# Altium project BLE_Motion_Tracker.PrjPcb
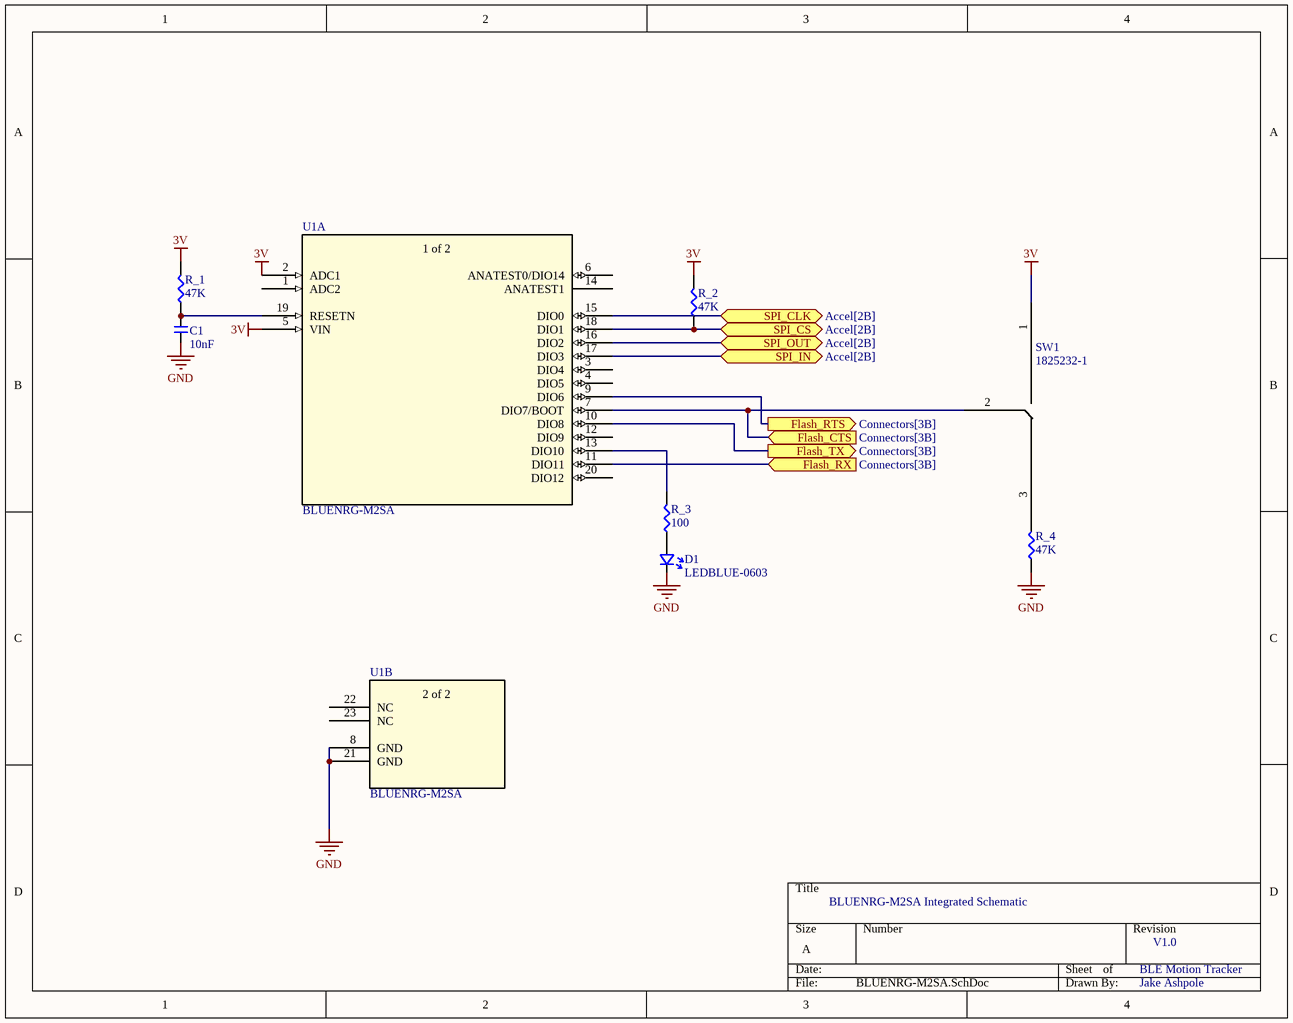
[diagram p0: BLUENRG-M2SA.SchDoc]
3 sheets, 15 parts. Net scope: flat (ports and power ports of the same name join across sheets).
Board file: BLE_Motion_Tracker_PCB.PcbDoc
Sheets:
  BLUENRG-M2SA.SchDoc
  Accel.SchDoc
  Connectors.SchDoc

## Sheet BLUENRG-M2SA.SchDoc
size A; SheetNumber: 1; SheetTotal: 3

### Parts
C1  10nF  [CAP-0603]
D1  LEDBLUE-0603  [LEDBLUE-0603]
R_1  47K  [RES-0603]
R_2  47K  [RES-0603]
R_3  100  [RES-0603]
R_4  47K  [RES-0603]
SW1  1825232-1  [1825232-1_TEC]
U1  BLUENRG-M2SA  [BLUENRG-2M_STM]  (parts A,B of 3)

### Ports
Flash_CTS (in, see Connectors[3B]), Flash_RTS (out, see Connectors[3B]), Flash_RX (in, see Connectors[3B]), Flash_TX (out, see Connectors[3B]), SPI_CLK (bidir, see Accel[2B]), SPI_CS (bidir, see Accel[2B]), SPI_IN (bidir, see Accel[2B]), SPI_OUT (bidir, see Accel[2B])

### Nets
3V: R_1.2 R_2.2 SW1.1 U1.2(ADC1) U1.5(VIN)
GND: C1.1 D1.K R_4.1 U1.8(GND) U1.21(GND)
NetC1_2: C1.2 R_1.1 U1.19(RESETN)
NetD1_A: D1.A R_3.1
NetJ1_2: U1.9(DIO6) ; port Flash_RTS
NetJ1_4: U1.11(DIO11) ; port Flash_RX
NetJ1_5: U1.10(DIO8) ; port Flash_TX
NetJ1_6: SW1.2 U1.7(DIO7/BOOT) ; port Flash_CTS
NetMT1_1: U1.17(DIO3) ; port SPI_IN
NetMT1_12: R_2.1 U1.18(DIO1) ; port SPI_CS
NetMT1_13: U1.15(DIO0) ; port SPI_CLK
NetMT1_14: U1.16(DIO2) ; port SPI_OUT
NetR_3_2: R_3.2 U1.13(DIO10)
NetR_4_2: R_4.2 SW1.3

Not connected (* = marked no-connect by the designer): U1 1(ADC2) 3(DIO4) 4(DIO5) 6(ANATEST0/DIO14) 12(DIO9) 14(ANATEST1) 20(DIO12) 22(NC) 23(NC)

### Notes on the sheet
- BLUENRG-M2SA Integrated Schematic
- BLE Motion Tracker
- V1.0
- Jake Ashpole
- (in symbol BLUENRG-M2SA, part A) 1 of 2
- (in symbol BLUENRG-M2SA, part B) 2 of 2

### Library data of the parts
C1 = CMP-009-000303-1: Source: ife19_Elec_Library.SchLib; Design Item ID: CAP-0603
D1 = CMP-009-000191-1: Design Item ID: LEDBLUE-0603; Source: ife19_Elec_Library.SchLib
R_1-R_4 = CMP-014-000032-1: Source: ife19_Elec_Library.SchLib; Design Item ID: RES-0603
SW1 = 1825232-1: https://www.mouser.com/ProductDetail/655-1825232-1; Mfr_Name: TE Connectivity; RefDes: RefDes; Type: Type
U1 = BLUENRG-M2SA: https://www.mouser.com/ProductDetail/STMicroelectronics/BLUENRG-M2SA?qs=%252B6g0mu59x7K3hjyySj690A%3D%3D; Mfr_Name: STMicroelectronics; RefDes: RefDes; Type: Type

## Sheet Accel.SchDoc
size A; SheetNumber: 2; SheetTotal: 2
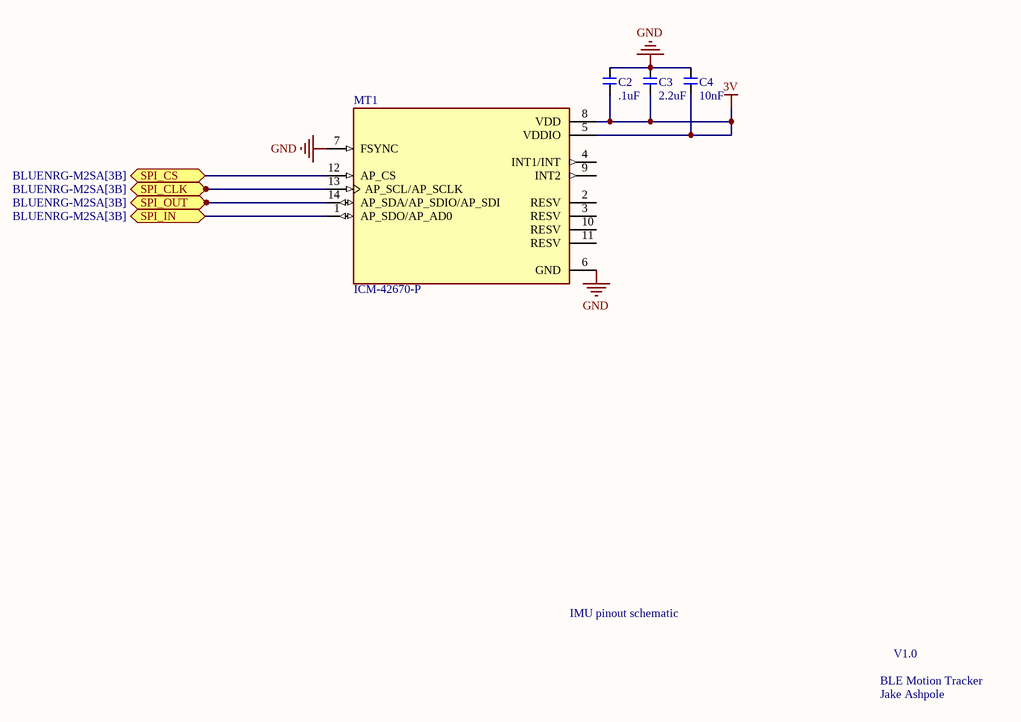
[diagram p1: Accel.SchDoc]

### Parts
C2  .1uF  [CAP-0603]
C3  2.2uF  [CAP-0603]
C4  10nF  [CAP-0603]
MT1  ICM-42670-P  [XDCR_ICM-42670-P]

### Ports
SPI_CLK (bidir, see BLUENRG-M2SA[3B]), SPI_CS (bidir, see BLUENRG-M2SA[3B]), SPI_IN (bidir, see BLUENRG-M2SA[3B]), SPI_OUT (bidir, see BLUENRG-M2SA[3B])

### Nets
3V: C2.1 C3.1 C4.1 MT1.5(VDDIO) MT1.8(VDD)
GND: C2.2 C3.2 C4.2 MT1.6(GND) MT1.7(FSYNC)
NetMT1_1: MT1.1(AP_SDO/AP_AD0) ; port SPI_IN
NetMT1_12: MT1.12(AP_CS) ; port SPI_CS
NetMT1_13: MT1.13(AP_SCL/AP_SCLK) ; port SPI_CLK
NetMT1_14: MT1.14(AP_SDA/AP_SDIO/AP_SDI) ; port SPI_OUT

Not connected (* = marked no-connect by the designer): MT1 2(RESV) 3(RESV) 4(INT1/INT) 9(INT2) 10(RESV) 11(RESV)

### Notes on the sheet
- IMU pinout schematic
- BLE Motion Tracker
- V1.0
- Jake Ashpole

### Library data of the parts
C2-C4 = CMP-009-000303-1: Source: ife19_Elec_Library.SchLib; Design Item ID: CAP-0603
MT1 = ICM-42670-P: https://www.mouser.com/ProductDetail/TDK-InvenSense/ICM-42670-P?qs=iLbezkQI%2BsgK8sMF5V7fQQ%3D%3D; Package: None; Price: None; Value: *; MP: ICM-42670-P; Availability: Unavailable

## Sheet Connectors.SchDoc
size A; SheetNumber: 3; SheetTotal: 3
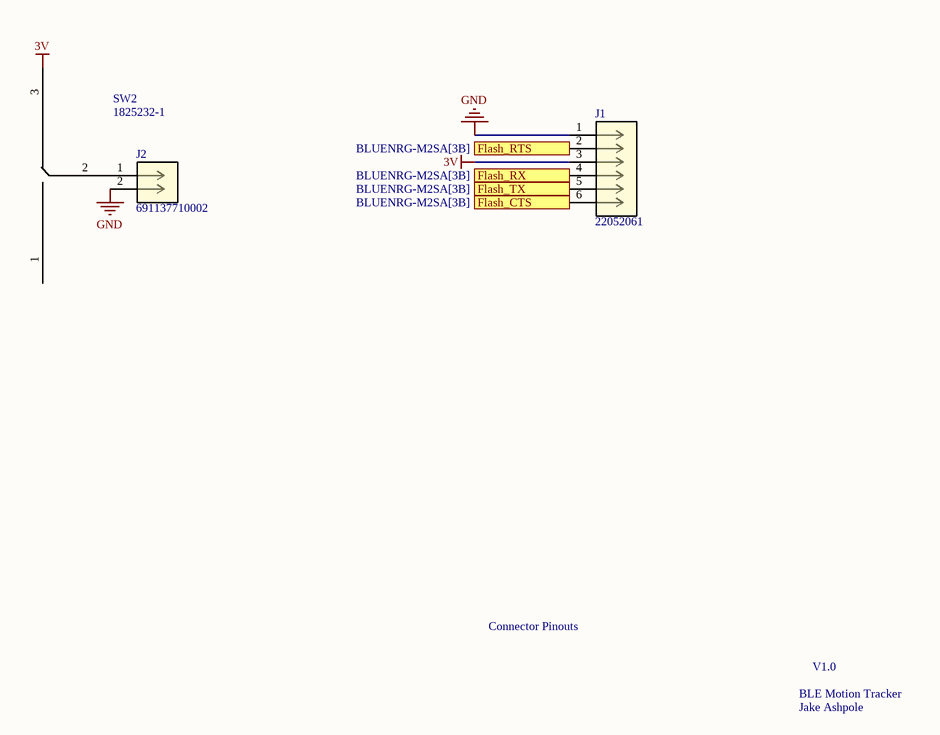
[diagram p2: Connectors.SchDoc]

### Parts
J1  22052061  [CONN_22-05-2061_MOL]
J2  691137710002  [CONN2_710002_WRE]
SW2  1825232-1  [1825232-1_TEC]

### Ports
Flash_CTS (out, see BLUENRG-M2SA[3B]), Flash_RTS (in, see BLUENRG-M2SA[3B]), Flash_RX (out, see BLUENRG-M2SA[3B]), Flash_TX (in, see BLUENRG-M2SA[3B])

### Nets
3V: J1.3 SW2.3
GND: J1.1 J2.2
NetJ1_2: J1.2 ; port Flash_RTS
NetJ1_4: J1.4 ; port Flash_RX
NetJ1_5: J1.5 ; port Flash_TX
NetJ1_6: J1.6 ; port Flash_CTS
NetJ2_1: J2.1 SW2.2

Not connected (* = marked no-connect by the designer): SW2 1

### Notes on the sheet
- Connector Pinouts
- BLE Motion Tracker
- V1.0
- Jake Ashpole

### Library data of the parts
J1 = 22052061: FTDI UART Flashing connector -- https://www.mouser.com/ProductDetail/Molex/22-05-2061?qs=th8CuLdcYnn%252BP%252BN0RJkmpg%3D%3D; Mfr_Name: Molex Connector Corporation; RefDes: RefDes; Type: Type
J2 = 691137710002: Connector to provide Battery voltage -- https://www.mouser.com/ProductDetail/Wurth-Elektronik/691137910002?qs=sPbYRqrBIVkdp9j8kfiV1w%3D%3D; Mfr_Name: Wurth Electronics; RefDes: RefDes; Type: Type
SW2 = 1825232-1: as SW1 on sheet BLUENRG-M2SA; RefDes: RefDes; Type: Type

## Nets that join several sheets
3V: BLUENRG-M2SA (5 pins), Accel (5 pins), Connectors (J1.3 SW2.3)
GND: BLUENRG-M2SA (5 pins), Accel (5 pins), Connectors (J1.1 J2.2)
NetJ1_2: BLUENRG-M2SA (U1.9), Connectors (J1.2)
NetJ1_4: BLUENRG-M2SA (U1.11), Connectors (J1.4)
NetJ1_5: BLUENRG-M2SA (U1.10), Connectors (J1.5)
NetJ1_6: BLUENRG-M2SA (SW1.2 U1.7), Connectors (J1.6)
NetMT1_1: BLUENRG-M2SA (U1.17), Accel (MT1.1)
NetMT1_12: BLUENRG-M2SA (R_2.1 U1.18), Accel (MT1.12)
NetMT1_13: BLUENRG-M2SA (U1.15), Accel (MT1.13)
NetMT1_14: BLUENRG-M2SA (U1.16), Accel (MT1.14)